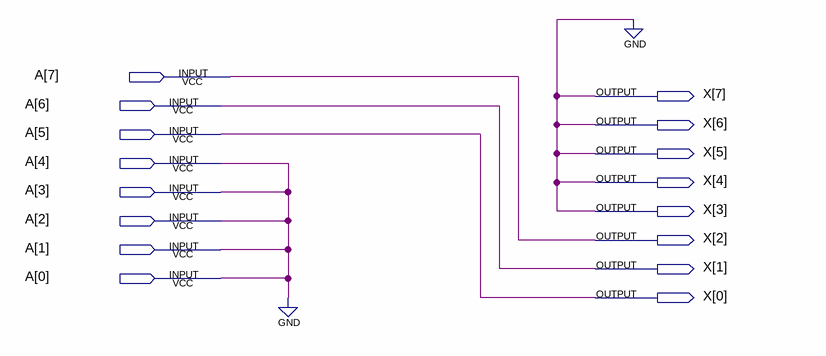
[diagram p0: schematic sheet]
// Quartus schematic CORR5.bdf as structural Verilog: 0 symbols, 16 pins
module CORR5 (
  input  [7:0] A,
  output [7:0] X
);


  assign A[3:0] = {4{A[4]}};
  assign X = {{5{1'b0}}, A[7:5]};
  // also tied to GND on the sheet: A[4]
endmodule
